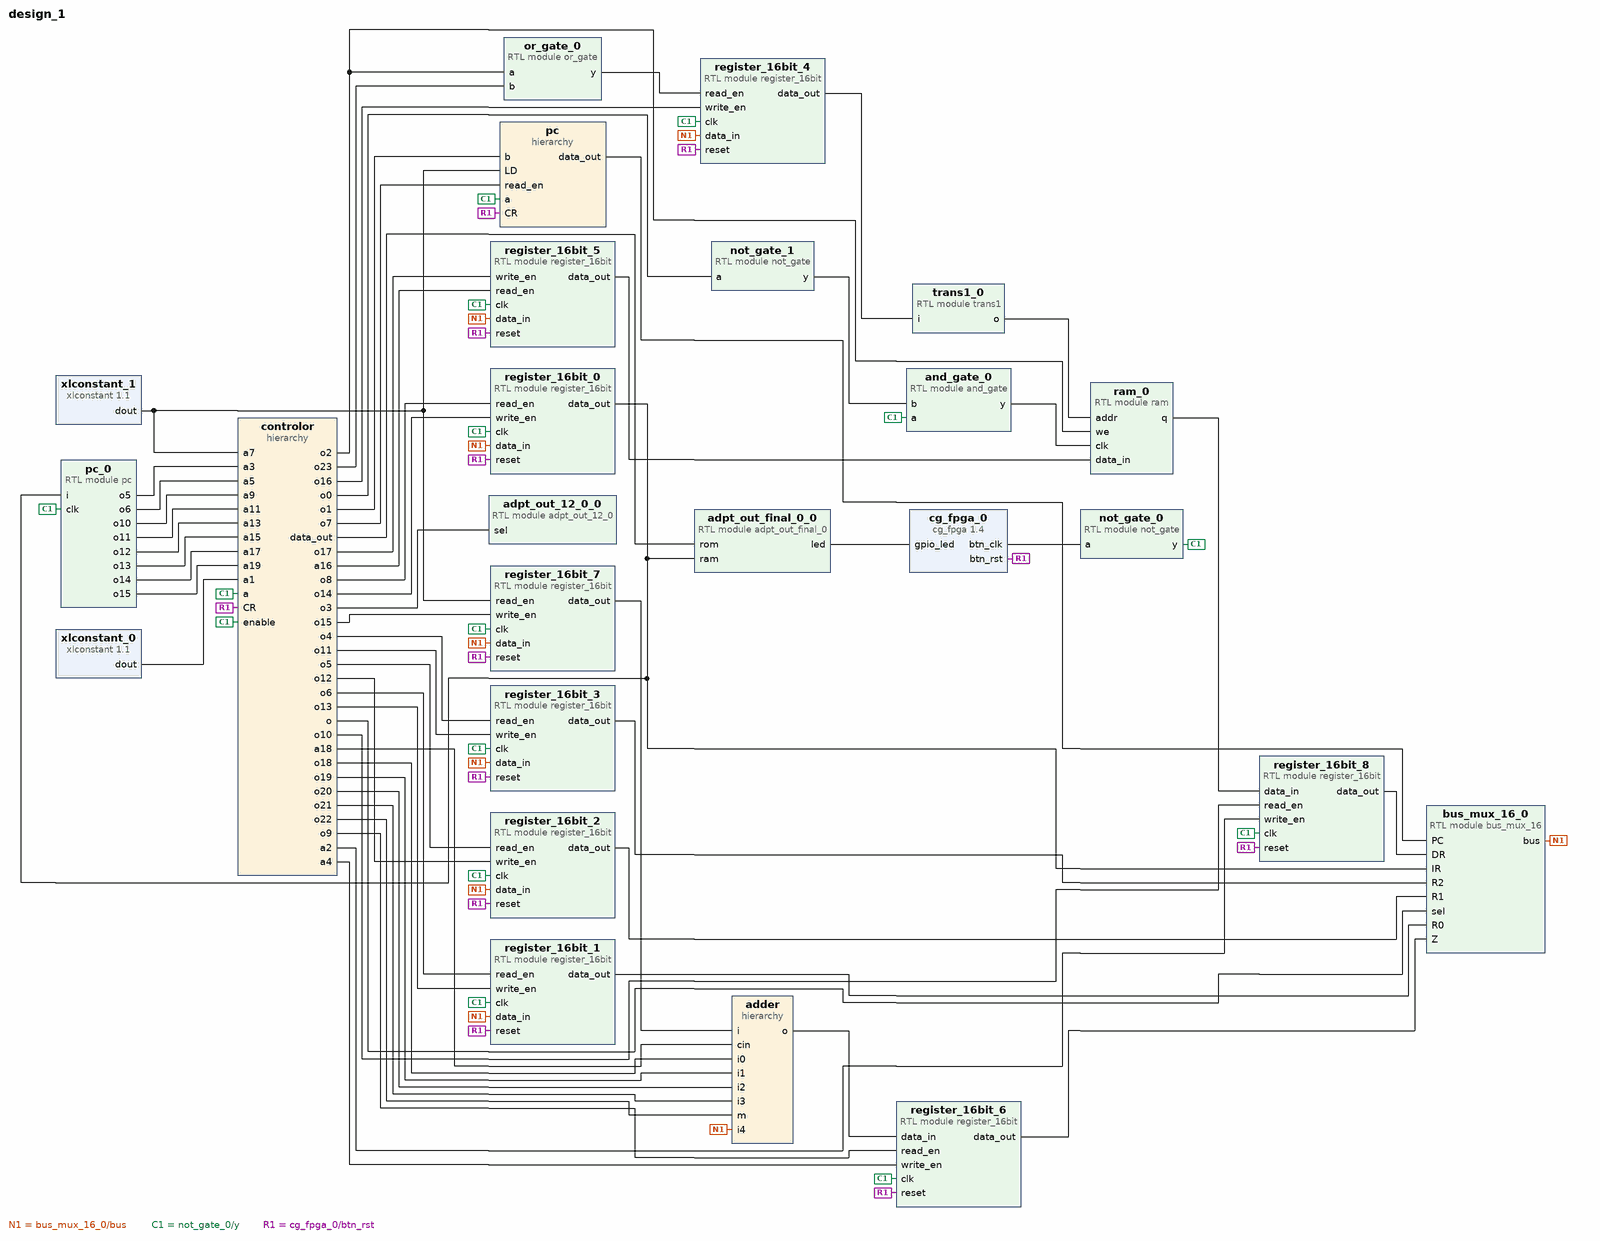
[diagram p0: block diagram of the top level]
# Vivado block design design_1, xc7z020clg400-1, Vivado 2024.2
create_bd_design design_1

create_bd_cell -type ip -vlnv educg.net:user:cg_fpga:1.4 cg_fpga_0
create_bd_cell -type hier adder
create_bd_cell -type ip -vlnv xilinx.com:ip:xlconstant:1.1 xlconstant_0
set_property -dict {CONFIG.CONST_VAL 0} [get_bd_cells xlconstant_0]
create_bd_cell -type ip -vlnv xilinx.com:ip:xlconstant:1.1 xlconstant_1
create_bd_cell -type hier pc
create_bd_cell -type module -reference pc pc_0
create_bd_cell -type module -reference register_16bit register_16bit_0
create_bd_cell -type module -reference bus_mux_16 bus_mux_16_0
create_bd_cell -type module -reference register_16bit register_16bit_1
create_bd_cell -type module -reference register_16bit register_16bit_2
create_bd_cell -type module -reference register_16bit register_16bit_3
create_bd_cell -type module -reference register_16bit register_16bit_4
create_bd_cell -type module -reference register_16bit register_16bit_5
create_bd_cell -type module -reference register_16bit register_16bit_6
create_bd_cell -type module -reference register_16bit register_16bit_7
create_bd_cell -type module -reference register_16bit register_16bit_8
create_bd_cell -type hier controlor
create_bd_cell -type module -reference or_gate or_gate_0
create_bd_cell -type module -reference and_gate and_gate_0
create_bd_cell -type module -reference not_gate not_gate_1
create_bd_cell -type module -reference ram ram_0
create_bd_cell -type module -reference trans1 trans1_0
create_bd_cell -type module -reference not_gate not_gate_0
create_bd_cell -type module -reference adpt_out_final_0 adpt_out_final_0_0
create_bd_cell -type module -reference adpt_out_12_0 adpt_out_12_0_0

# ---- hierarchy /adder ----
current_bd_instance /adder
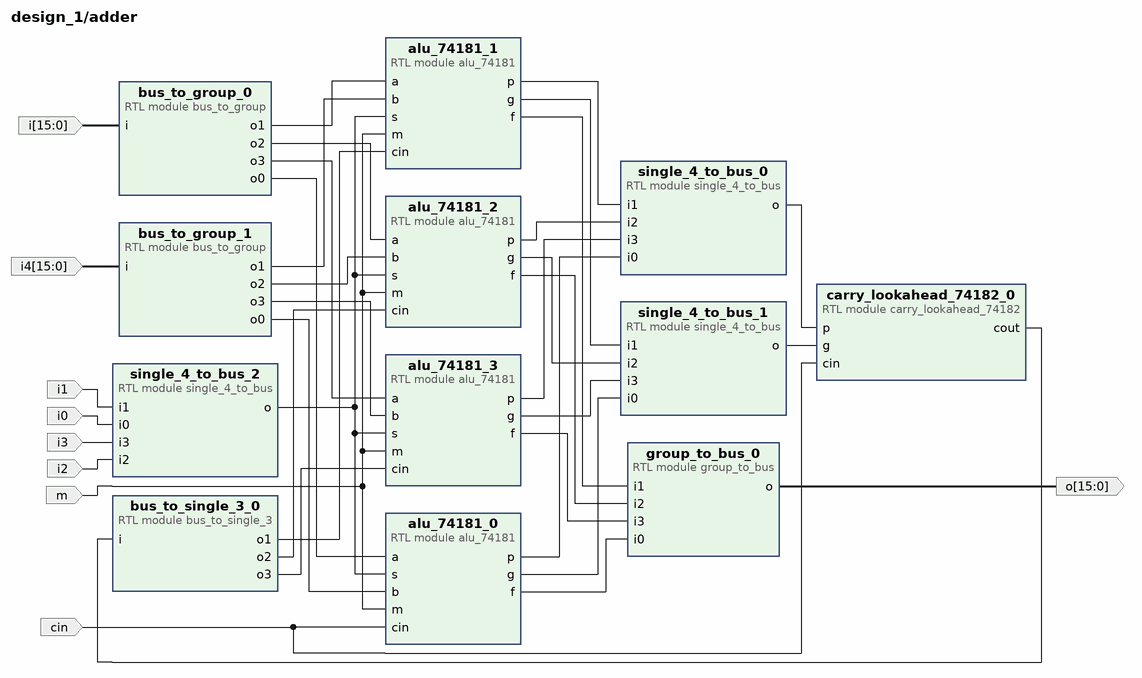
[diagram p1: block diagram inside /adder]
create_bd_pin -dir I -from 15 -to 0 i
create_bd_pin -dir I i3
create_bd_pin -dir I i2
create_bd_pin -dir I i1
create_bd_pin -dir I i0
create_bd_pin -dir I m
create_bd_pin -dir I cin
create_bd_pin -dir O -from 15 -to 0 o
create_bd_pin -dir I -from 15 -to 0 i4

create_bd_cell -type module -reference bus_to_group bus_to_group_0
create_bd_cell -type module -reference bus_to_group bus_to_group_1
create_bd_cell -type module -reference single_4_to_bus single_4_to_bus_2
create_bd_cell -type module -reference alu_74181 alu_74181_3
create_bd_cell -type module -reference alu_74181 alu_74181_2
create_bd_cell -type module -reference alu_74181 alu_74181_1
create_bd_cell -type module -reference alu_74181 alu_74181_0
create_bd_cell -type module -reference single_4_to_bus single_4_to_bus_0
create_bd_cell -type module -reference single_4_to_bus single_4_to_bus_1
create_bd_cell -type module -reference group_to_bus group_to_bus_0
create_bd_cell -type module -reference carry_lookahead_74182 carry_lookahead_74182_0
create_bd_cell -type module -reference bus_to_single_3 bus_to_single_3_0

# ---- hierarchy /pc ----
current_bd_instance /pc
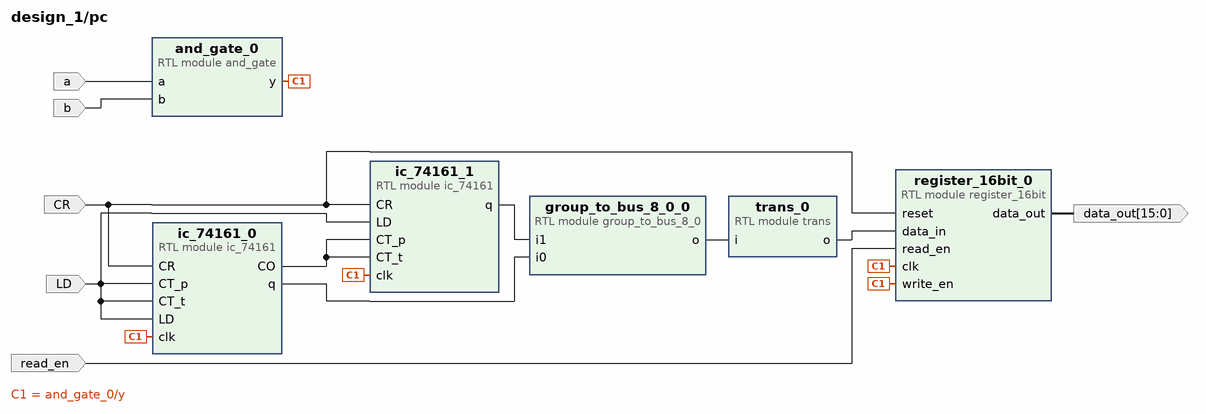
[diagram p2: block diagram inside /pc]
create_bd_pin -dir I a
create_bd_pin -dir I b
create_bd_pin -dir I CR
create_bd_pin -dir I LD
create_bd_pin -dir I read_en
create_bd_pin -dir O -from 15 -to 0 data_out

create_bd_cell -type module -reference and_gate and_gate_0
create_bd_cell -type module -reference group_to_bus_8_0 group_to_bus_8_0_0
create_bd_cell -type module -reference ic_74161 ic_74161_0
create_bd_cell -type module -reference ic_74161 ic_74161_1
create_bd_cell -type module -reference register_16bit register_16bit_0
create_bd_cell -type module -reference trans trans_0

# ---- hierarchy /controlor ----
current_bd_instance /controlor
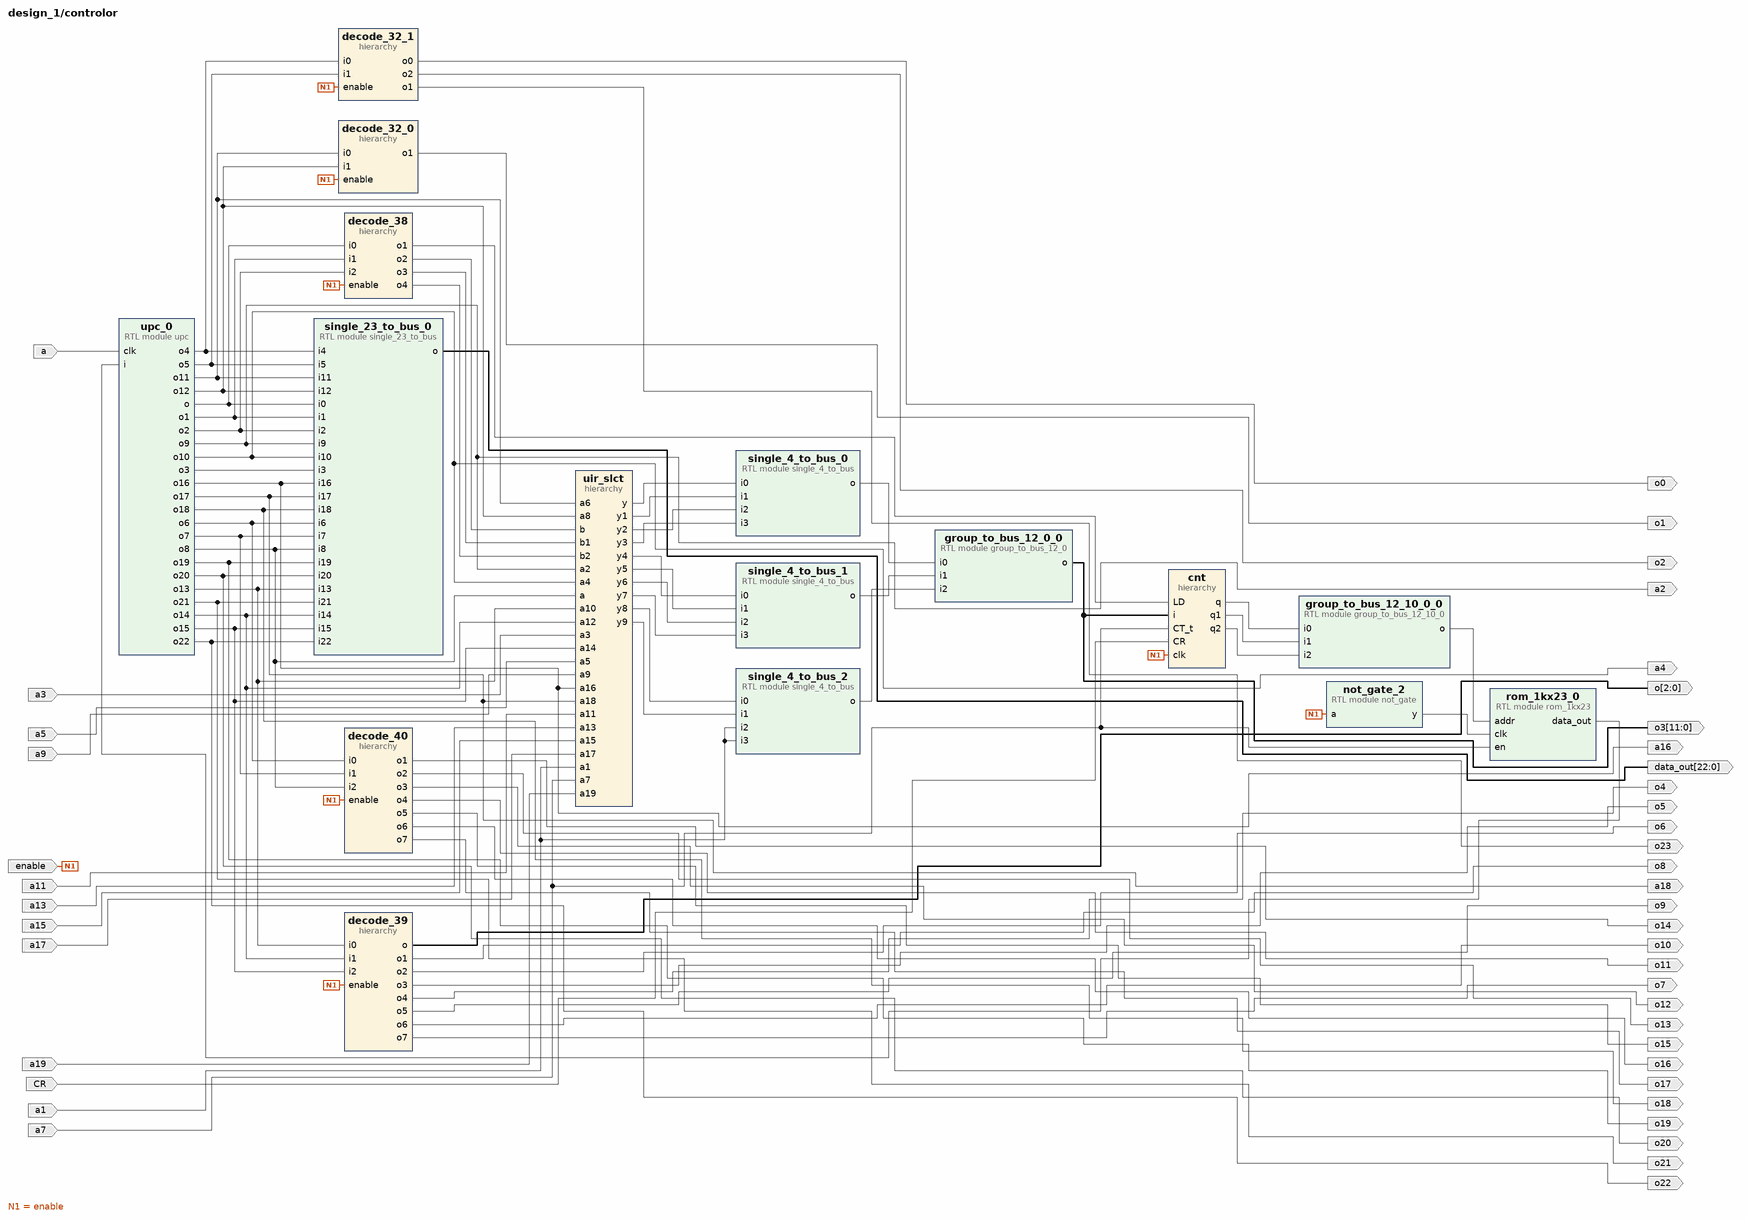
[diagram p3: block diagram inside /controlor]
create_bd_pin -dir I a
create_bd_pin -dir O o22
create_bd_pin -dir O o21
create_bd_pin -dir O o20
create_bd_pin -dir O o19
create_bd_pin -dir O o18
create_bd_pin -dir O a18
create_bd_pin -dir O a16
create_bd_pin -dir O a4
create_bd_pin -dir O a2
create_bd_pin -dir I CR
create_bd_pin -dir I enable
create_bd_pin -dir I a7
create_bd_pin -dir O o0
create_bd_pin -dir O o2
create_bd_pin -dir O o4
create_bd_pin -dir O o5
create_bd_pin -dir O o6
create_bd_pin -dir O o7
create_bd_pin -dir O o8
create_bd_pin -dir O o9
create_bd_pin -dir O o10
create_bd_pin -dir O -from 2 -to 0 o
create_bd_pin -dir O o11
create_bd_pin -dir O o12
create_bd_pin -dir O o13
create_bd_pin -dir O o14
create_bd_pin -dir O o15
create_bd_pin -dir O o16
create_bd_pin -dir O o17
create_bd_pin -dir I a1
create_bd_pin -dir I a3
create_bd_pin -dir I a5
create_bd_pin -dir I a9
create_bd_pin -dir I a11
create_bd_pin -dir I a13
create_bd_pin -dir I a15
create_bd_pin -dir I a17
create_bd_pin -dir I a19
create_bd_pin -dir O o23
create_bd_pin -dir O o1
create_bd_pin -dir O -from 22 -to 0 data_out
create_bd_pin -dir O -from 11 -to 0 o3

create_bd_cell -type module -reference group_to_bus_12_0 group_to_bus_12_0_0
create_bd_cell -type module -reference group_to_bus_12_10_0 group_to_bus_12_10_0_0
create_bd_cell -type module -reference single_4_to_bus single_4_to_bus_1
create_bd_cell -type module -reference single_4_to_bus single_4_to_bus_2
create_bd_cell -type module -reference upc upc_0
create_bd_cell -type hier cnt
create_bd_cell -type hier decode_32_1
create_bd_cell -type hier decode_38
create_bd_cell -type hier decode_39
create_bd_cell -type hier decode_40
create_bd_cell -type hier uir_slct
create_bd_cell -type module -reference single_4_to_bus single_4_to_bus_0
create_bd_cell -type hier decode_32_0
create_bd_cell -type module -reference rom_1kx23 rom_1kx23_0
create_bd_cell -type module -reference single_23_to_bus single_23_to_bus_0
create_bd_cell -type module -reference not_gate not_gate_2

# ---- hierarchy /controlor/cnt ----
current_bd_instance /controlor/cnt
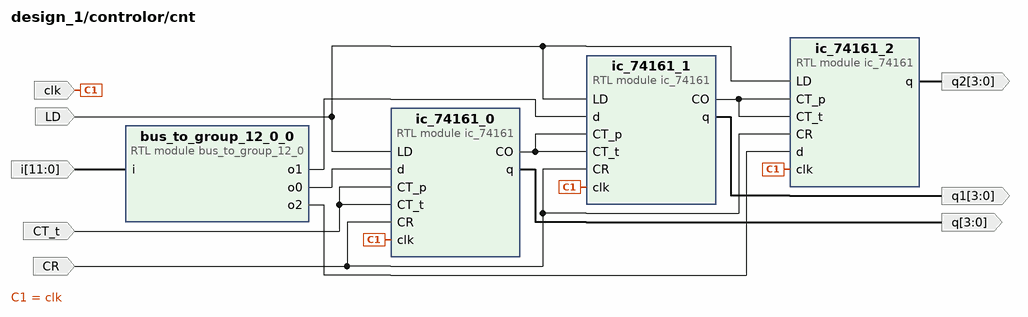
[diagram p4: block diagram inside /controlor/cnt]
create_bd_pin -dir O -from 3 -to 0 q2
create_bd_pin -dir O -from 3 -to 0 q1
create_bd_pin -dir I CR
create_bd_pin -dir O -from 3 -to 0 q
create_bd_pin -dir I -type clk clk
create_bd_pin -dir I -from 11 -to 0 i
create_bd_pin -dir I CT_t
create_bd_pin -dir I LD

create_bd_cell -type module -reference ic_74161 ic_74161_0
create_bd_cell -type module -reference ic_74161 ic_74161_1
create_bd_cell -type module -reference ic_74161 ic_74161_2
create_bd_cell -type module -reference bus_to_group_12_0 bus_to_group_12_0_0

# ---- hierarchy /controlor/decode_32_1 ----
current_bd_instance /controlor/decode_32_1
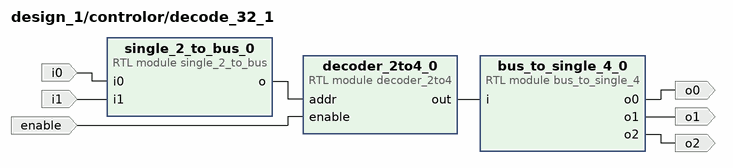
[diagram p5: block diagram inside /controlor/decode_32_1]
create_bd_pin -dir I i1
create_bd_pin -dir I i0
create_bd_pin -dir I enable
create_bd_pin -dir O o0
create_bd_pin -dir O o2
create_bd_pin -dir O o1

create_bd_cell -type module -reference bus_to_single_4 bus_to_single_4_0
create_bd_cell -type module -reference decoder_2to4 decoder_2to4_0
create_bd_cell -type module -reference single_2_to_bus single_2_to_bus_0

# ---- hierarchy /controlor/decode_38 ----
current_bd_instance /controlor/decode_38
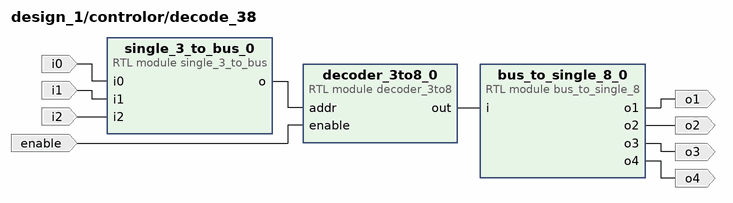
[diagram p6: block diagram inside /controlor/decode_38]
create_bd_pin -dir O o4
create_bd_pin -dir O o3
create_bd_pin -dir O o2
create_bd_pin -dir I enable
create_bd_pin -dir I i2
create_bd_pin -dir I i1
create_bd_pin -dir I i0
create_bd_pin -dir O o1

create_bd_cell -type module -reference bus_to_single_8 bus_to_single_8_0
create_bd_cell -type module -reference decoder_3to8 decoder_3to8_0
create_bd_cell -type module -reference single_3_to_bus single_3_to_bus_0

# ---- hierarchy /controlor/decode_39 ----
current_bd_instance /controlor/decode_39
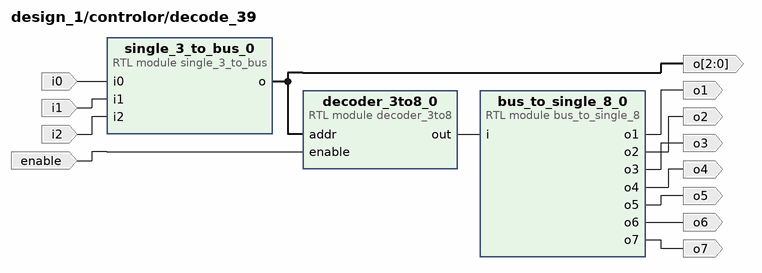
[diagram p7: block diagram inside /controlor/decode_39]
create_bd_pin -dir O o4
create_bd_pin -dir O o3
create_bd_pin -dir O o2
create_bd_pin -dir I enable
create_bd_pin -dir I i2
create_bd_pin -dir I i1
create_bd_pin -dir I i0
create_bd_pin -dir O o7
create_bd_pin -dir O o1
create_bd_pin -dir O o5
create_bd_pin -dir O o6
create_bd_pin -dir O -from 2 -to 0 o

create_bd_cell -type module -reference bus_to_single_8 bus_to_single_8_0
create_bd_cell -type module -reference decoder_3to8 decoder_3to8_0
create_bd_cell -type module -reference single_3_to_bus single_3_to_bus_0

# ---- hierarchy /controlor/decode_40 ----
current_bd_instance /controlor/decode_40
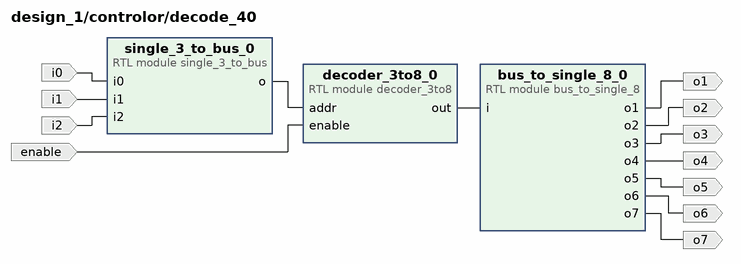
[diagram p8: block diagram inside /controlor/decode_40]
create_bd_pin -dir O o4
create_bd_pin -dir O o3
create_bd_pin -dir O o2
create_bd_pin -dir I enable
create_bd_pin -dir I i2
create_bd_pin -dir I i1
create_bd_pin -dir I i0
create_bd_pin -dir O o1
create_bd_pin -dir O o5
create_bd_pin -dir O o6
create_bd_pin -dir O o7

create_bd_cell -type module -reference bus_to_single_8 bus_to_single_8_0
create_bd_cell -type module -reference decoder_3to8 decoder_3to8_0
create_bd_cell -type module -reference single_3_to_bus single_3_to_bus_0

# ---- hierarchy /controlor/uir_slct ----
current_bd_instance /controlor/uir_slct
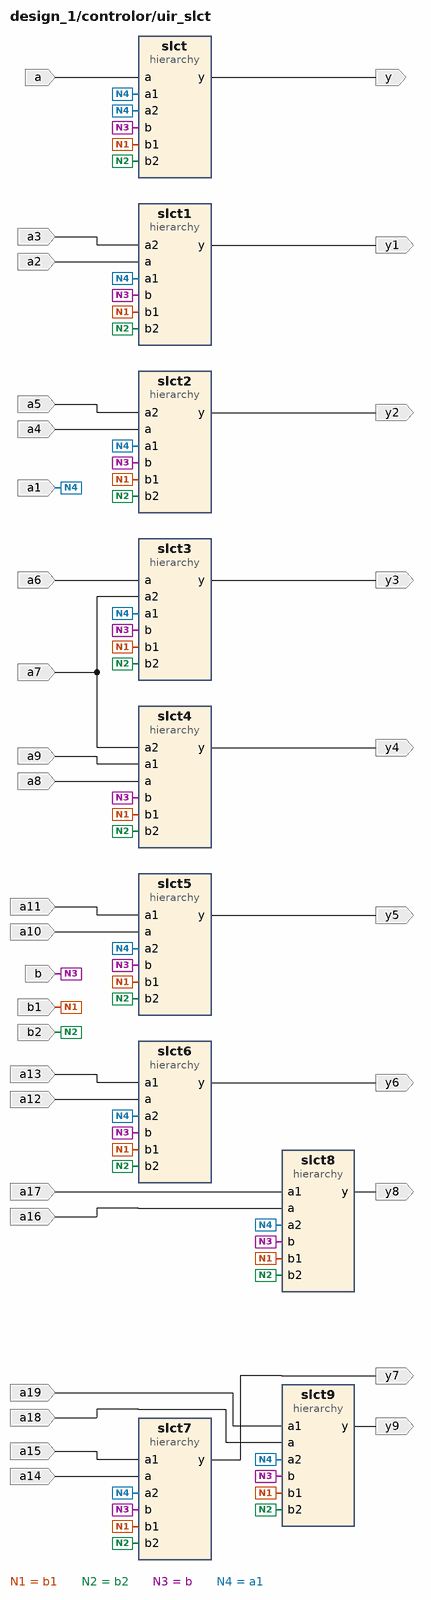
[diagram p9: block diagram inside /controlor/uir_slct]
create_bd_pin -dir I a
create_bd_pin -dir I b
create_bd_pin -dir I a1
create_bd_pin -dir I b1
create_bd_pin -dir I b2
create_bd_pin -dir I a2
create_bd_pin -dir I a3
create_bd_pin -dir I a4
create_bd_pin -dir I a5
create_bd_pin -dir I a6
create_bd_pin -dir I a7
create_bd_pin -dir I a8
create_bd_pin -dir I a9
create_bd_pin -dir I a10
create_bd_pin -dir I a11
create_bd_pin -dir I a12
create_bd_pin -dir I a13
create_bd_pin -dir I a14
create_bd_pin -dir I a15
create_bd_pin -dir I a16
create_bd_pin -dir I a17
create_bd_pin -dir I a18
create_bd_pin -dir I a19
create_bd_pin -dir O y
create_bd_pin -dir O y1
create_bd_pin -dir O y2
create_bd_pin -dir O y3
create_bd_pin -dir O y4
create_bd_pin -dir O y5
create_bd_pin -dir O y6
create_bd_pin -dir O y7
create_bd_pin -dir O y8
create_bd_pin -dir O y9

create_bd_cell -type hier slct
create_bd_cell -type hier slct1
create_bd_cell -type hier slct2
create_bd_cell -type hier slct3
create_bd_cell -type hier slct4
create_bd_cell -type hier slct5
create_bd_cell -type hier slct6
create_bd_cell -type hier slct7
create_bd_cell -type hier slct8
create_bd_cell -type hier slct9

# ---- hierarchy /controlor/uir_slct/slct ----
current_bd_instance /controlor/uir_slct/slct
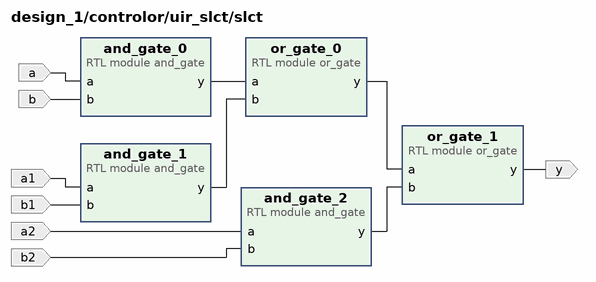
[diagram p10: block diagram inside /controlor/uir_slct/slct]
create_bd_pin -dir I a
create_bd_pin -dir I b
create_bd_pin -dir I a1
create_bd_pin -dir I b1
create_bd_pin -dir I a2
create_bd_pin -dir I b2
create_bd_pin -dir O y

create_bd_cell -type module -reference and_gate and_gate_0
create_bd_cell -type module -reference and_gate and_gate_1
create_bd_cell -type module -reference and_gate and_gate_2
create_bd_cell -type module -reference or_gate or_gate_0
create_bd_cell -type module -reference or_gate or_gate_1

# ---- hierarchy /controlor/uir_slct/slct1 ----
current_bd_instance /controlor/uir_slct/slct1
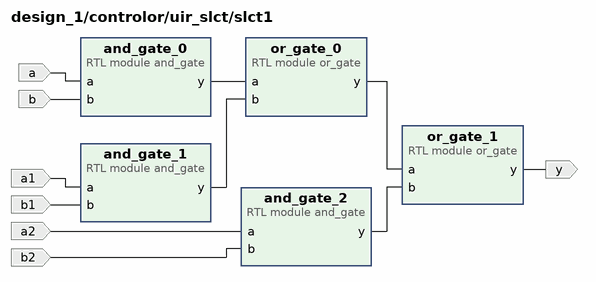
[diagram p11: block diagram inside /controlor/uir_slct/slct1]
create_bd_pin -dir I a
create_bd_pin -dir I b
create_bd_pin -dir I a1
create_bd_pin -dir I b1
create_bd_pin -dir I a2
create_bd_pin -dir I b2
create_bd_pin -dir O y

create_bd_cell -type module -reference and_gate and_gate_0
create_bd_cell -type module -reference and_gate and_gate_1
create_bd_cell -type module -reference and_gate and_gate_2
create_bd_cell -type module -reference or_gate or_gate_0
create_bd_cell -type module -reference or_gate or_gate_1

# ---- hierarchy /controlor/uir_slct/slct2 ----
current_bd_instance /controlor/uir_slct/slct2
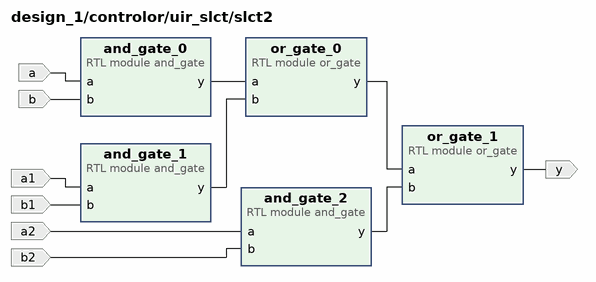
[diagram p12: block diagram inside /controlor/uir_slct/slct2]
create_bd_pin -dir I a
create_bd_pin -dir I b
create_bd_pin -dir I a1
create_bd_pin -dir I b1
create_bd_pin -dir I a2
create_bd_pin -dir I b2
create_bd_pin -dir O y

create_bd_cell -type module -reference and_gate and_gate_0
create_bd_cell -type module -reference and_gate and_gate_1
create_bd_cell -type module -reference and_gate and_gate_2
create_bd_cell -type module -reference or_gate or_gate_0
create_bd_cell -type module -reference or_gate or_gate_1

# ---- hierarchy /controlor/uir_slct/slct3 ----
current_bd_instance /controlor/uir_slct/slct3
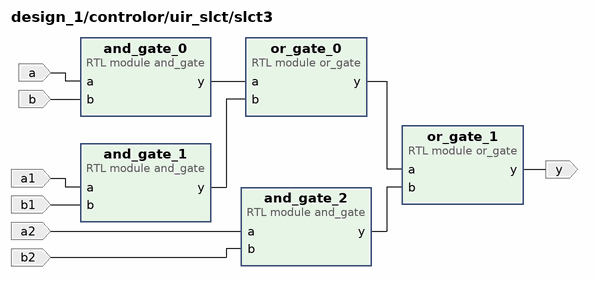
[diagram p13: block diagram inside /controlor/uir_slct/slct3]
create_bd_pin -dir I a
create_bd_pin -dir I b
create_bd_pin -dir I a1
create_bd_pin -dir I b1
create_bd_pin -dir I a2
create_bd_pin -dir I b2
create_bd_pin -dir O y

create_bd_cell -type module -reference and_gate and_gate_0
create_bd_cell -type module -reference and_gate and_gate_1
create_bd_cell -type module -reference and_gate and_gate_2
create_bd_cell -type module -reference or_gate or_gate_0
create_bd_cell -type module -reference or_gate or_gate_1

# ---- hierarchy /controlor/uir_slct/slct4 ----
current_bd_instance /controlor/uir_slct/slct4
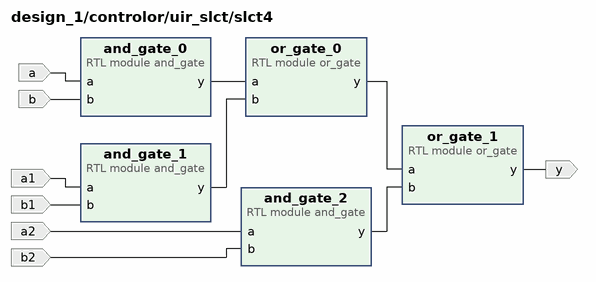
[diagram p14: block diagram inside /controlor/uir_slct/slct4]
create_bd_pin -dir I a
create_bd_pin -dir I b
create_bd_pin -dir I a1
create_bd_pin -dir I b1
create_bd_pin -dir I a2
create_bd_pin -dir I b2
create_bd_pin -dir O y

create_bd_cell -type module -reference and_gate and_gate_0
create_bd_cell -type module -reference and_gate and_gate_1
create_bd_cell -type module -reference and_gate and_gate_2
create_bd_cell -type module -reference or_gate or_gate_0
create_bd_cell -type module -reference or_gate or_gate_1

# ---- hierarchy /controlor/uir_slct/slct5 ----
current_bd_instance /controlor/uir_slct/slct5
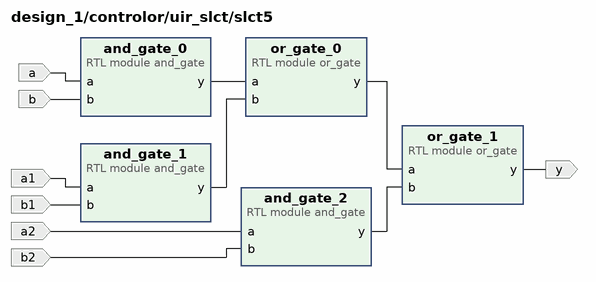
[diagram p15: block diagram inside /controlor/uir_slct/slct5]
create_bd_pin -dir I a
create_bd_pin -dir I b
create_bd_pin -dir I a1
create_bd_pin -dir I b1
create_bd_pin -dir I a2
create_bd_pin -dir I b2
create_bd_pin -dir O y

create_bd_cell -type module -reference and_gate and_gate_0
create_bd_cell -type module -reference and_gate and_gate_1
create_bd_cell -type module -reference and_gate and_gate_2
create_bd_cell -type module -reference or_gate or_gate_0
create_bd_cell -type module -reference or_gate or_gate_1

# ---- hierarchy /controlor/uir_slct/slct6 ----
current_bd_instance /controlor/uir_slct/slct6
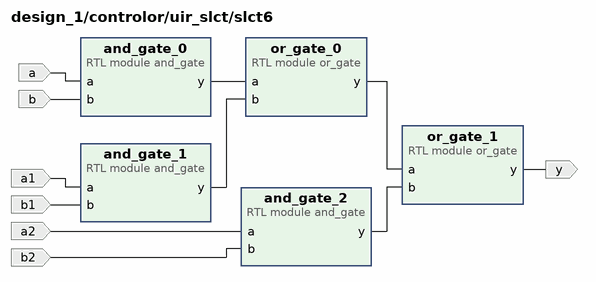
[diagram p16: block diagram inside /controlor/uir_slct/slct6]
create_bd_pin -dir I a
create_bd_pin -dir I b
create_bd_pin -dir I a1
create_bd_pin -dir I b1
create_bd_pin -dir I a2
create_bd_pin -dir I b2
create_bd_pin -dir O y

create_bd_cell -type module -reference and_gate and_gate_0
create_bd_cell -type module -reference and_gate and_gate_1
create_bd_cell -type module -reference and_gate and_gate_2
create_bd_cell -type module -reference or_gate or_gate_0
create_bd_cell -type module -reference or_gate or_gate_1

# ---- hierarchy /controlor/uir_slct/slct7 ----
current_bd_instance /controlor/uir_slct/slct7
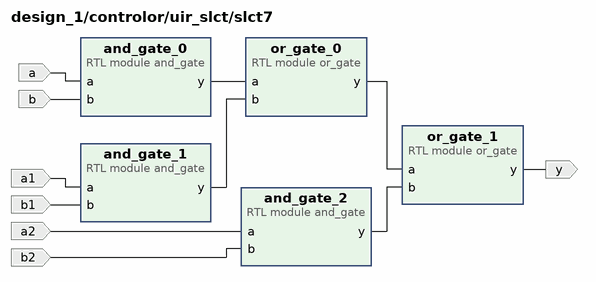
[diagram p17: block diagram inside /controlor/uir_slct/slct7]
create_bd_pin -dir I a
create_bd_pin -dir I b
create_bd_pin -dir I a1
create_bd_pin -dir I b1
create_bd_pin -dir I a2
create_bd_pin -dir I b2
create_bd_pin -dir O y

create_bd_cell -type module -reference and_gate and_gate_0
create_bd_cell -type module -reference and_gate and_gate_1
create_bd_cell -type module -reference and_gate and_gate_2
create_bd_cell -type module -reference or_gate or_gate_0
create_bd_cell -type module -reference or_gate or_gate_1

# ---- hierarchy /controlor/uir_slct/slct8 ----
current_bd_instance /controlor/uir_slct/slct8
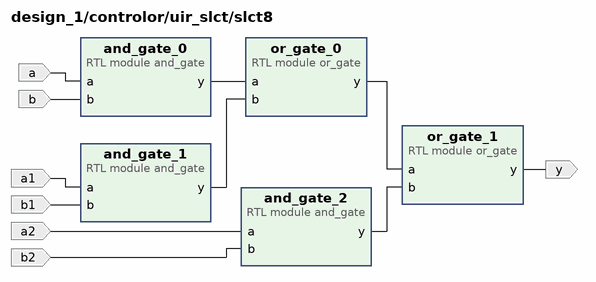
[diagram p18: block diagram inside /controlor/uir_slct/slct8]
create_bd_pin -dir I a
create_bd_pin -dir I b
create_bd_pin -dir I a1
create_bd_pin -dir I b1
create_bd_pin -dir I a2
create_bd_pin -dir I b2
create_bd_pin -dir O y

create_bd_cell -type module -reference and_gate and_gate_0
create_bd_cell -type module -reference and_gate and_gate_1
create_bd_cell -type module -reference and_gate and_gate_2
create_bd_cell -type module -reference or_gate or_gate_0
create_bd_cell -type module -reference or_gate or_gate_1

# ---- hierarchy /controlor/uir_slct/slct9 ----
current_bd_instance /controlor/uir_slct/slct9
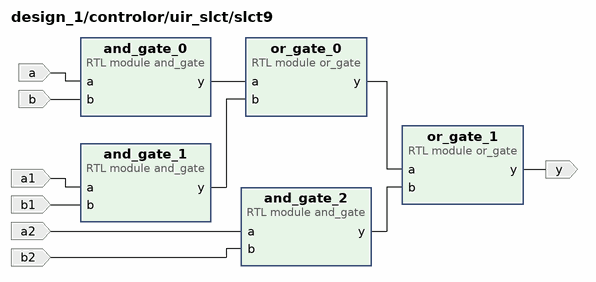
[diagram p19: block diagram inside /controlor/uir_slct/slct9]
create_bd_pin -dir I a
create_bd_pin -dir I b
create_bd_pin -dir I a1
create_bd_pin -dir I b1
create_bd_pin -dir I a2
create_bd_pin -dir I b2
create_bd_pin -dir O y

create_bd_cell -type module -reference and_gate and_gate_0
create_bd_cell -type module -reference and_gate and_gate_1
create_bd_cell -type module -reference and_gate and_gate_2
create_bd_cell -type module -reference or_gate or_gate_0
create_bd_cell -type module -reference or_gate or_gate_1

# ---- hierarchy /controlor/decode_32_0 ----
current_bd_instance /controlor/decode_32_0
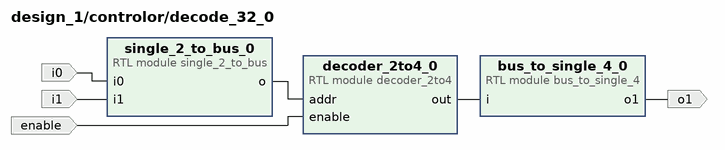
[diagram p20: block diagram inside /controlor/decode_32_0]
create_bd_pin -dir I i1
create_bd_pin -dir I i0
create_bd_pin -dir O o1
create_bd_pin -dir I enable

create_bd_cell -type module -reference bus_to_single_4 bus_to_single_4_0
create_bd_cell -type module -reference decoder_2to4 decoder_2to4_0
create_bd_cell -type module -reference single_2_to_bus single_2_to_bus_0

# ---- connections ----

current_bd_instance /adder
connect_bd_net [get_bd_pins cin] [get_bd_pins carry_lookahead_74182_0/cin] [get_bd_pins alu_74181_0/cin]
connect_bd_net [get_bd_pins m] [get_bd_pins alu_74181_2/m] [get_bd_pins alu_74181_1/m] [get_bd_pins alu_74181_0/m] [get_bd_pins alu_74181_3/m]
connect_bd_net [get_bd_pins single_4_to_bus_2/o] \
  [get_bd_pins alu_74181_3/s] [get_bd_pins alu_74181_2/s] [get_bd_pins alu_74181_1/s] [get_bd_pins alu_74181_0/s]
connect_bd_net [get_bd_pins alu_74181_0/f] [get_bd_pins group_to_bus_0/i0]
connect_bd_net [get_bd_pins alu_74181_0/g] [get_bd_pins single_4_to_bus_1/i0]
connect_bd_net [get_bd_pins alu_74181_0/p] [get_bd_pins single_4_to_bus_0/i0]
connect_bd_net [get_bd_pins alu_74181_1/f] [get_bd_pins group_to_bus_0/i1]
connect_bd_net [get_bd_pins alu_74181_1/g] [get_bd_pins single_4_to_bus_1/i1]
connect_bd_net [get_bd_pins alu_74181_1/p] [get_bd_pins single_4_to_bus_0/i1]
connect_bd_net [get_bd_pins alu_74181_2/f] [get_bd_pins group_to_bus_0/i2]
connect_bd_net [get_bd_pins alu_74181_2/g] [get_bd_pins single_4_to_bus_1/i2]
connect_bd_net [get_bd_pins alu_74181_2/p] [get_bd_pins single_4_to_bus_0/i2]
connect_bd_net [get_bd_pins alu_74181_3/f] [get_bd_pins group_to_bus_0/i3]
connect_bd_net [get_bd_pins alu_74181_3/g] [get_bd_pins single_4_to_bus_1/i3]
connect_bd_net [get_bd_pins alu_74181_3/p] [get_bd_pins single_4_to_bus_0/i3]
connect_bd_net -net bus_mux_16_0_bus [get_bd_pins i1] [get_bd_pins single_4_to_bus_2/i1]
connect_bd_net [get_bd_pins bus_to_group_0/o0] [get_bd_pins alu_74181_0/a]
connect_bd_net [get_bd_pins bus_to_group_0/o1] [get_bd_pins alu_74181_1/a]
connect_bd_net [get_bd_pins bus_to_group_0/o2] [get_bd_pins alu_74181_2/a]
connect_bd_net [get_bd_pins bus_to_group_0/o3] [get_bd_pins alu_74181_3/a]
connect_bd_net [get_bd_pins bus_to_group_1/o0] [get_bd_pins alu_74181_0/b]
connect_bd_net [get_bd_pins bus_to_group_1/o1] [get_bd_pins alu_74181_1/b]
connect_bd_net [get_bd_pins bus_to_group_1/o2] [get_bd_pins alu_74181_2/b]
connect_bd_net [get_bd_pins bus_to_group_1/o3] [get_bd_pins alu_74181_3/b]
connect_bd_net [get_bd_pins bus_to_single_3_0/o1] [get_bd_pins alu_74181_1/cin]
connect_bd_net [get_bd_pins bus_to_single_3_0/o2] [get_bd_pins alu_74181_2/cin]
connect_bd_net [get_bd_pins bus_to_single_3_0/o3] [get_bd_pins alu_74181_3/cin]
connect_bd_net [get_bd_pins carry_lookahead_74182_0/cout] [get_bd_pins bus_to_single_3_0/i]
connect_bd_net -net cg_fpga_0_tx_0 [get_bd_pins i0] [get_bd_pins single_4_to_bus_2/i0]
connect_bd_net [get_bd_pins group_to_bus_0/o] [get_bd_pins o]
connect_bd_net -net i4_1 [get_bd_pins i4] [get_bd_pins bus_to_group_1/i]
connect_bd_net -net register_16bit_0_data_out [get_bd_pins i] [get_bd_pins bus_to_group_0/i]
connect_bd_net -net register_16bit_3_data_out [get_bd_pins i3] [get_bd_pins single_4_to_bus_2/i3]
connect_bd_net -net register_16bit_5_data_out [get_bd_pins i2] [get_bd_pins single_4_to_bus_2/i2]
connect_bd_net [get_bd_pins single_4_to_bus_0/o] [get_bd_pins carry_lookahead_74182_0/p]
connect_bd_net [get_bd_pins single_4_to_bus_1/o] [get_bd_pins carry_lookahead_74182_0/g]

current_bd_instance /pc
connect_bd_net [get_bd_pins LD] [get_bd_pins ic_74161_0/LD] [get_bd_pins ic_74161_0/CT_p] [get_bd_pins ic_74161_0/CT_t] [get_bd_pins ic_74161_1/LD]
connect_bd_net [get_bd_pins a] [get_bd_pins and_gate_0/a]
connect_bd_net [get_bd_pins and_gate_0/y] \
  [get_bd_pins register_16bit_0/clk] [get_bd_pins register_16bit_0/write_en] [get_bd_pins ic_74161_0/clk] \
  [get_bd_pins ic_74161_1/clk]
connect_bd_net -net cg_fpga_0_btn_rst [get_bd_pins CR] [get_bd_pins register_16bit_0/reset] [get_bd_pins ic_74161_0/CR] [get_bd_pins ic_74161_1/CR]
connect_bd_net -net decode_32_0_o1 [get_bd_pins b] [get_bd_pins and_gate_0/b]
connect_bd_net -net decode_39_o7 [get_bd_pins read_en] [get_bd_pins register_16bit_0/read_en]
connect_bd_net [get_bd_pins group_to_bus_8_0_0/o] [get_bd_pins trans_0/i]
connect_bd_net [get_bd_pins ic_74161_0/CO] [get_bd_pins ic_74161_1/CT_p] [get_bd_pins ic_74161_1/CT_t]
connect_bd_net [get_bd_pins ic_74161_0/q] [get_bd_pins group_to_bus_8_0_0/i0]
connect_bd_net [get_bd_pins ic_74161_1/q] [get_bd_pins group_to_bus_8_0_0/i1]
connect_bd_net [get_bd_pins register_16bit_0/data_out] [get_bd_pins data_out]
connect_bd_net [get_bd_pins trans_0/o] [get_bd_pins register_16bit_0/data_in]

current_bd_instance /controlor
connect_bd_net -net LD_1 [get_bd_pins decode_38/o1] [get_bd_pins cnt/LD]
connect_bd_net [get_bd_pins enable] \
  [get_bd_pins decode_38/enable] [get_bd_pins decode_39/enable] [get_bd_pins decode_40/enable] \
  [get_bd_pins decode_32_1/enable] [get_bd_pins cnt/clk] [get_bd_pins decode_32_0/enable] [get_bd_pins not_gate_2/a]
connect_bd_net -net and_gate_2_y [get_bd_pins a] [get_bd_pins upc_0/clk]
connect_bd_net -net bus_to_single_8_0_o2 [get_bd_pins decode_38/o2] [get_bd_pins uir_slct/b]
connect_bd_net -net bus_to_single_8_0_o3 [get_bd_pins decode_38/o3] [get_bd_pins uir_slct/b1]
connect_bd_net -net bus_to_single_8_0_o4 [get_bd_pins decode_38/o4] [get_bd_pins uir_slct/b2]
connect_bd_net -net cg_fpga_0_btn_rst [get_bd_pins CR] [get_bd_pins cnt/CR]
connect_bd_net [get_bd_pins cnt/q] [get_bd_pins group_to_bus_12_10_0_0/i0]
connect_bd_net [get_bd_pins cnt/q1] [get_bd_pins group_to_bus_12_10_0_0/i1]
connect_bd_net [get_bd_pins cnt/q2] [get_bd_pins group_to_bus_12_10_0_0/i2]
connect_bd_net [get_bd_pins decode_32_0/o1] [get_bd_pins o1]
connect_bd_net [get_bd_pins decode_32_1/o0] [get_bd_pins o0]
connect_bd_net [get_bd_pins decode_32_1/o1] [get_bd_pins o23]
connect_bd_net [get_bd_pins decode_32_1/o2] [get_bd_pins o2]
connect_bd_net [get_bd_pins decode_39/o] [get_bd_pins o]
connect_bd_net [get_bd_pins decode_39/o1] [get_bd_pins o8]
connect_bd_net [get_bd_pins decode_39/o2] [get_bd_pins o6]
connect_bd_net [get_bd_pins decode_39/o3] [get_bd_pins o5]
connect_bd_net [get_bd_pins decode_39/o4] [get_bd_pins o4]
connect_bd_net [get_bd_pins decode_39/o5] [get_bd_pins o9]
connect_bd_net [get_bd_pins decode_39/o6] [get_bd_pins o10]
connect_bd_net [get_bd_pins decode_39/o7] [get_bd_pins o7]
connect_bd_net [get_bd_pins decode_40/o1] [get_bd_pins o14]
connect_bd_net [get_bd_pins decode_40/o2] [get_bd_pins o13]
connect_bd_net [get_bd_pins decode_40/o3] [get_bd_pins o12]
connect_bd_net [get_bd_pins decode_40/o4] [get_bd_pins o11]
connect_bd_net [get_bd_pins decode_40/o5] [get_bd_pins o15]
connect_bd_net [get_bd_pins decode_40/o6] [get_bd_pins o16]
connect_bd_net [get_bd_pins decode_40/o7] [get_bd_pins o17]
connect_bd_net [get_bd_pins group_to_bus_12_0_0/o] [get_bd_pins cnt/i] [get_bd_pins o3]
connect_bd_net [get_bd_pins group_to_bus_12_10_0_0/o] [get_bd_pins rom_1kx23_0/addr]
connect_bd_net [get_bd_pins not_gate_2/y] [get_bd_pins rom_1kx23_0/clk]
connect_bd_net -net pc_0_o5 [get_bd_pins a3] [get_bd_pins uir_slct/a3]
connect_bd_net -net pc_0_o6 [get_bd_pins a5] [get_bd_pins uir_slct/a5]
connect_bd_net -net pc_0_o10 [get_bd_pins a9] [get_bd_pins uir_slct/a9]
connect_bd_net -net pc_0_o11 [get_bd_pins a11] [get_bd_pins uir_slct/a11]
connect_bd_net -net pc_0_o12 [get_bd_pins a13] [get_bd_pins uir_slct/a13]
connect_bd_net -net pc_0_o13 [get_bd_pins a15] [get_bd_pins uir_slct/a15]
connect_bd_net -net pc_0_o14 [get_bd_pins a17] [get_bd_pins uir_slct/a17]
connect_bd_net -net pc_0_o15 [get_bd_pins a19] [get_bd_pins uir_slct/a19]
connect_bd_net [get_bd_pins rom_1kx23_0/data_out] [get_bd_pins upc_0/i]
connect_bd_net [get_bd_pins single_23_to_bus_0/o] [get_bd_pins data_out]
connect_bd_net [get_bd_pins single_4_to_bus_0/o] [get_bd_pins group_to_bus_12_0_0/i0]
connect_bd_net [get_bd_pins single_4_to_bus_1/o] [get_bd_pins group_to_bus_12_0_0/i1]
connect_bd_net [get_bd_pins single_4_to_bus_2/o] [get_bd_pins group_to_bus_12_0_0/i2]
connect_bd_net [get_bd_pins uir_slct/y] [get_bd_pins single_4_to_bus_0/i0]
connect_bd_net [get_bd_pins uir_slct/y1] [get_bd_pins single_4_to_bus_0/i1]
connect_bd_net [get_bd_pins uir_slct/y2] [get_bd_pins single_4_to_bus_0/i2]
connect_bd_net [get_bd_pins uir_slct/y3] [get_bd_pins single_4_to_bus_0/i3]
connect_bd_net [get_bd_pins uir_slct/y4] [get_bd_pins single_4_to_bus_1/i0]
connect_bd_net [get_bd_pins uir_slct/y5] [get_bd_pins single_4_to_bus_1/i1]
connect_bd_net [get_bd_pins uir_slct/y6] [get_bd_pins single_4_to_bus_1/i2]
connect_bd_net [get_bd_pins uir_slct/y7] [get_bd_pins single_4_to_bus_1/i3]
connect_bd_net [get_bd_pins uir_slct/y8] [get_bd_pins single_4_to_bus_2/i0]
connect_bd_net [get_bd_pins uir_slct/y9] [get_bd_pins single_4_to_bus_2/i1]
connect_bd_net [get_bd_pins upc_0/o] [get_bd_pins decode_38/i0] [get_bd_pins single_23_to_bus_0/i0]
connect_bd_net [get_bd_pins upc_0/o1] [get_bd_pins decode_38/i1] [get_bd_pins single_23_to_bus_0/i1]
connect_bd_net [get_bd_pins upc_0/o2] [get_bd_pins decode_38/i2] [get_bd_pins single_23_to_bus_0/i2]
connect_bd_net [get_bd_pins upc_0/o3] [get_bd_pins single_23_to_bus_0/i3]
connect_bd_net [get_bd_pins upc_0/o4] [get_bd_pins decode_32_1/i0] [get_bd_pins single_23_to_bus_0/i4]
connect_bd_net [get_bd_pins upc_0/o5] [get_bd_pins decode_32_1/i1] [get_bd_pins single_23_to_bus_0/i5]
connect_bd_net [get_bd_pins upc_0/o6] [get_bd_pins decode_40/i0] [get_bd_pins single_23_to_bus_0/i6]
connect_bd_net [get_bd_pins upc_0/o7] [get_bd_pins decode_40/i1] [get_bd_pins single_23_to_bus_0/i7]
connect_bd_net [get_bd_pins upc_0/o8] [get_bd_pins uir_slct/a] [get_bd_pins decode_40/i2] [get_bd_pins single_23_to_bus_0/i8]
connect_bd_net [get_bd_pins upc_0/o9] [get_bd_pins a2] [get_bd_pins uir_slct/a2] [get_bd_pins single_23_to_bus_0/i9]
connect_bd_net [get_bd_pins upc_0/o10] [get_bd_pins a4] [get_bd_pins uir_slct/a4] [get_bd_pins single_23_to_bus_0/i10]
connect_bd_net [get_bd_pins upc_0/o11] [get_bd_pins uir_slct/a6] [get_bd_pins decode_32_0/i0] [get_bd_pins single_23_to_bus_0/i11]
connect_bd_net [get_bd_pins upc_0/o12] [get_bd_pins uir_slct/a8] [get_bd_pins decode_32_0/i1] [get_bd_pins single_23_to_bus_0/i12]
connect_bd_net [get_bd_pins upc_0/o13] [get_bd_pins uir_slct/a10] [get_bd_pins decode_39/i0] [get_bd_pins single_23_to_bus_0/i13]
connect_bd_net [get_bd_pins upc_0/o14] [get_bd_pins uir_slct/a12] [get_bd_pins decode_39/i1] [get_bd_pins single_23_to_bus_0/i14]
connect_bd_net [get_bd_pins upc_0/o15] [get_bd_pins uir_slct/a14] [get_bd_pins decode_39/i2] [get_bd_pins single_23_to_bus_0/i15]
connect_bd_net [get_bd_pins upc_0/o16] [get_bd_pins a16] [get_bd_pins uir_slct/a16] [get_bd_pins single_23_to_bus_0/i16]
connect_bd_net [get_bd_pins upc_0/o17] [get_bd_pins a18] [get_bd_pins uir_slct/a18] [get_bd_pins single_23_to_bus_0/i17]
connect_bd_net [get_bd_pins upc_0/o18] [get_bd_pins o18] [get_bd_pins single_23_to_bus_0/i18]
connect_bd_net [get_bd_pins upc_0/o19] [get_bd_pins o19] [get_bd_pins single_23_to_bus_0/i19]
connect_bd_net [get_bd_pins upc_0/o20] [get_bd_pins o20] [get_bd_pins single_23_to_bus_0/i20]
connect_bd_net [get_bd_pins upc_0/o21] [get_bd_pins o21] [get_bd_pins single_23_to_bus_0/i21]
connect_bd_net [get_bd_pins upc_0/o22] [get_bd_pins o22] [get_bd_pins single_23_to_bus_0/i22]
connect_bd_net -net xlconstant_0_dout [get_bd_pins a1] [get_bd_pins uir_slct/a1] [get_bd_pins single_4_to_bus_2/i3] [get_bd_pins single_4_to_bus_2/i2]
connect_bd_net -net xlconstant_1_dout [get_bd_pins a7] [get_bd_pins uir_slct/a7] [get_bd_pins cnt/CT_t] [get_bd_pins rom_1kx23_0/en]

current_bd_instance /controlor/cnt
connect_bd_net -net D_trigger_0_q [get_bd_pins LD] [get_bd_pins ic_74161_0/LD] [get_bd_pins ic_74161_2/LD] [get_bd_pins ic_74161_1/LD]
connect_bd_net -net LD_1 [get_bd_pins CT_t] [get_bd_pins ic_74161_0/CT_p] [get_bd_pins ic_74161_0/CT_t]
connect_bd_net [get_bd_pins CR] [get_bd_pins ic_74161_0/CR] [get_bd_pins ic_74161_2/CR] [get_bd_pins ic_74161_1/CR]
connect_bd_net [get_bd_pins bus_to_group_12_0_0/o0] [get_bd_pins ic_74161_0/d]
connect_bd_net [get_bd_pins bus_to_group_12_0_0/o1] [get_bd_pins ic_74161_1/d]
connect_bd_net [get_bd_pins bus_to_group_12_0_0/o2] [get_bd_pins ic_74161_2/d]
connect_bd_net [get_bd_pins i] [get_bd_pins bus_to_group_12_0_0/i]
connect_bd_net [get_bd_pins ic_74161_0/CO] [get_bd_pins ic_74161_1/CT_p] [get_bd_pins ic_74161_1/CT_t]
connect_bd_net [get_bd_pins ic_74161_0/q] [get_bd_pins q]
connect_bd_net [get_bd_pins ic_74161_1/CO] [get_bd_pins ic_74161_2/CT_p] [get_bd_pins ic_74161_2/CT_t]
connect_bd_net [get_bd_pins ic_74161_1/q] [get_bd_pins q1]
connect_bd_net [get_bd_pins ic_74161_2/q] [get_bd_pins q2]
connect_bd_net -net not_gate_0_y [get_bd_pins clk] [get_bd_pins ic_74161_0/clk] [get_bd_pins ic_74161_2/clk] [get_bd_pins ic_74161_1/clk]

current_bd_instance /controlor/decode_32_1
connect_bd_net [get_bd_pins bus_to_single_4_0/o0] [get_bd_pins o0]
connect_bd_net [get_bd_pins bus_to_single_4_0/o1] [get_bd_pins o1]
connect_bd_net [get_bd_pins bus_to_single_4_0/o2] [get_bd_pins o2]
connect_bd_net [get_bd_pins decoder_2to4_0/out] [get_bd_pins bus_to_single_4_0/i]
connect_bd_net [get_bd_pins enable] [get_bd_pins decoder_2to4_0/enable]
connect_bd_net [get_bd_pins single_2_to_bus_0/o] [get_bd_pins decoder_2to4_0/addr]
connect_bd_net -net upc_0_o11 [get_bd_pins i0] [get_bd_pins single_2_to_bus_0/i0]
connect_bd_net -net upc_0_o12 [get_bd_pins i1] [get_bd_pins single_2_to_bus_0/i1]

current_bd_instance /controlor/decode_38
connect_bd_net [get_bd_pins enable] [get_bd_pins decoder_3to8_0/enable]
connect_bd_net [get_bd_pins bus_to_single_8_0/o1] [get_bd_pins o1]
connect_bd_net [get_bd_pins bus_to_single_8_0/o2] [get_bd_pins o2]
connect_bd_net [get_bd_pins bus_to_single_8_0/o3] [get_bd_pins o3]
connect_bd_net [get_bd_pins bus_to_single_8_0/o4] [get_bd_pins o4]
connect_bd_net [get_bd_pins decoder_3to8_0/out] [get_bd_pins bus_to_single_8_0/i]
connect_bd_net [get_bd_pins single_3_to_bus_0/o] [get_bd_pins decoder_3to8_0/addr]
connect_bd_net -net upc_0_o [get_bd_pins i0] [get_bd_pins single_3_to_bus_0/i0]
connect_bd_net -net upc_0_o1 [get_bd_pins i1] [get_bd_pins single_3_to_bus_0/i1]
connect_bd_net -net upc_0_o2 [get_bd_pins i2] [get_bd_pins single_3_to_bus_0/i2]

current_bd_instance /controlor/decode_39
connect_bd_net [get_bd_pins enable] [get_bd_pins decoder_3to8_0/enable]
connect_bd_net [get_bd_pins bus_to_single_8_0/o1] [get_bd_pins o1]
connect_bd_net [get_bd_pins bus_to_single_8_0/o2] [get_bd_pins o2]
connect_bd_net [get_bd_pins bus_to_single_8_0/o3] [get_bd_pins o3]
connect_bd_net [get_bd_pins bus_to_single_8_0/o4] [get_bd_pins o4]
connect_bd_net [get_bd_pins bus_to_single_8_0/o5] [get_bd_pins o5]
connect_bd_net [get_bd_pins bus_to_single_8_0/o6] [get_bd_pins o6]
connect_bd_net [get_bd_pins bus_to_single_8_0/o7] [get_bd_pins o7]
connect_bd_net [get_bd_pins decoder_3to8_0/out] [get_bd_pins bus_to_single_8_0/i]
connect_bd_net [get_bd_pins single_3_to_bus_0/o] [get_bd_pins decoder_3to8_0/addr] [get_bd_pins o]
connect_bd_net -net upc_0_o [get_bd_pins i0] [get_bd_pins single_3_to_bus_0/i0]
connect_bd_net -net upc_0_o1 [get_bd_pins i1] [get_bd_pins single_3_to_bus_0/i1]
connect_bd_net -net upc_0_o2 [get_bd_pins i2] [get_bd_pins single_3_to_bus_0/i2]

current_bd_instance /controlor/decode_40
connect_bd_net [get_bd_pins enable] [get_bd_pins decoder_3to8_0/enable]
connect_bd_net [get_bd_pins bus_to_single_8_0/o1] [get_bd_pins o1]
connect_bd_net [get_bd_pins bus_to_single_8_0/o2] [get_bd_pins o2]
connect_bd_net [get_bd_pins bus_to_single_8_0/o3] [get_bd_pins o3]
connect_bd_net [get_bd_pins bus_to_single_8_0/o4] [get_bd_pins o4]
connect_bd_net [get_bd_pins bus_to_single_8_0/o5] [get_bd_pins o5]
connect_bd_net [get_bd_pins bus_to_single_8_0/o6] [get_bd_pins o6]
connect_bd_net [get_bd_pins bus_to_single_8_0/o7] [get_bd_pins o7]
connect_bd_net [get_bd_pins decoder_3to8_0/out] [get_bd_pins bus_to_single_8_0/i]
connect_bd_net [get_bd_pins single_3_to_bus_0/o] [get_bd_pins decoder_3to8_0/addr]
connect_bd_net -net upc_0_o [get_bd_pins i0] [get_bd_pins single_3_to_bus_0/i0]
connect_bd_net -net upc_0_o1 [get_bd_pins i1] [get_bd_pins single_3_to_bus_0/i1]
connect_bd_net -net upc_0_o2 [get_bd_pins i2] [get_bd_pins single_3_to_bus_0/i2]

current_bd_instance /controlor/uir_slct
connect_bd_net -net a1_1 [get_bd_pins a19] [get_bd_pins slct9/a1]
connect_bd_net -net a1_2 [get_bd_pins a17] [get_bd_pins slct8/a1]
connect_bd_net -net a1_3 [get_bd_pins a15] [get_bd_pins slct7/a1]
connect_bd_net -net a1_4 [get_bd_pins a13] [get_bd_pins slct6/a1]
connect_bd_net -net a1_5 [get_bd_pins a11] [get_bd_pins slct5/a1]
connect_bd_net -net a1_6 [get_bd_pins a9] [get_bd_pins slct4/a1]
connect_bd_net -net a2_1 [get_bd_pins a5] [get_bd_pins slct2/a2]
connect_bd_net -net a2_2 [get_bd_pins a3] [get_bd_pins slct1/a2]
connect_bd_net -net b1_1 [get_bd_pins b1] \
  [get_bd_pins slct1/b1] [get_bd_pins slct2/b1] [get_bd_pins slct3/b1] [get_bd_pins slct4/b1] [get_bd_pins slct5/b1] \
  [get_bd_pins slct6/b1] [get_bd_pins slct7/b1] [get_bd_pins slct8/b1] [get_bd_pins slct9/b1] [get_bd_pins slct/b1]
connect_bd_net -net b2_1 [get_bd_pins b2] \
  [get_bd_pins slct1/b2] [get_bd_pins slct2/b2] [get_bd_pins slct3/b2] [get_bd_pins slct4/b2] [get_bd_pins slct5/b2] \
  [get_bd_pins slct6/b2] [get_bd_pins slct7/b2] [get_bd_pins slct8/b2] [get_bd_pins slct9/b2] [get_bd_pins slct/b2]
connect_bd_net [get_bd_pins b] \
  [get_bd_pins slct4/b] [get_bd_pins slct5/b] [get_bd_pins slct6/b] [get_bd_pins slct7/b] [get_bd_pins slct1/b] \
  [get_bd_pins slct3/b] [get_bd_pins slct8/b] [get_bd_pins slct2/b] [get_bd_pins slct9/b] [get_bd_pins slct/b]
connect_bd_net [get_bd_pins slct1/y] [get_bd_pins y1]
connect_bd_net [get_bd_pins slct2/y] [get_bd_pins y2]
connect_bd_net [get_bd_pins slct3/y] [get_bd_pins y3]
connect_bd_net [get_bd_pins slct4/y] [get_bd_pins y4]
connect_bd_net [get_bd_pins slct5/y] [get_bd_pins y5]
connect_bd_net [get_bd_pins slct6/y] [get_bd_pins y6]
connect_bd_net [get_bd_pins slct7/y] [get_bd_pins y7]
connect_bd_net [get_bd_pins slct8/y] [get_bd_pins y8]
connect_bd_net [get_bd_pins slct9/y] [get_bd_pins y9]
connect_bd_net [get_bd_pins slct/y] [get_bd_pins y]
connect_bd_net -net upc_0_o8 [get_bd_pins a] [get_bd_pins slct/a]
connect_bd_net -net upc_0_o9 [get_bd_pins a2] [get_bd_pins slct1/a]
connect_bd_net -net upc_0_o10 [get_bd_pins a4] [get_bd_pins slct2/a]
connect_bd_net -net upc_0_o11 [get_bd_pins a6] [get_bd_pins slct3/a]
connect_bd_net -net upc_0_o12 [get_bd_pins a8] [get_bd_pins slct4/a]
connect_bd_net -net upc_0_o13 [get_bd_pins a10] [get_bd_pins slct5/a]
connect_bd_net -net upc_0_o14 [get_bd_pins a12] [get_bd_pins slct6/a]
connect_bd_net -net upc_0_o15 [get_bd_pins a14] [get_bd_pins slct7/a]
connect_bd_net -net upc_0_o16 [get_bd_pins a16] [get_bd_pins slct8/a]
connect_bd_net -net upc_0_o17 [get_bd_pins a18] [get_bd_pins slct9/a]
connect_bd_net -net xlconstant_0_dout [get_bd_pins a1] \
  [get_bd_pins slct1/a1] [get_bd_pins slct2/a1] [get_bd_pins slct3/a1] [get_bd_pins slct/a2] [get_bd_pins slct9/a2] \
  [get_bd_pins slct8/a2] [get_bd_pins slct7/a2] [get_bd_pins slct6/a2] [get_bd_pins slct5/a2] [get_bd_pins slct/a1]
connect_bd_net -net xlconstant_1_dout [get_bd_pins a7] [get_bd_pins slct4/a2] [get_bd_pins slct3/a2]

current_bd_instance /controlor/uir_slct/slct
connect_bd_net -net a1_1 [get_bd_pins a1] [get_bd_pins and_gate_1/a]
connect_bd_net -net a2_1 [get_bd_pins a2] [get_bd_pins and_gate_2/a]
connect_bd_net [get_bd_pins a] [get_bd_pins and_gate_0/a]
connect_bd_net [get_bd_pins and_gate_0/y] [get_bd_pins or_gate_0/a]
connect_bd_net [get_bd_pins and_gate_1/y] [get_bd_pins or_gate_0/b]
connect_bd_net [get_bd_pins and_gate_2/y] [get_bd_pins or_gate_1/b]
connect_bd_net -net b1_1 [get_bd_pins b1] [get_bd_pins and_gate_1/b]
connect_bd_net -net b2_1 [get_bd_pins b2] [get_bd_pins and_gate_2/b]
connect_bd_net [get_bd_pins b] [get_bd_pins and_gate_0/b]
connect_bd_net [get_bd_pins or_gate_0/y] [get_bd_pins or_gate_1/a]
connect_bd_net [get_bd_pins or_gate_1/y] [get_bd_pins y]

current_bd_instance /controlor/uir_slct/slct1
connect_bd_net -net a1_1 [get_bd_pins a1] [get_bd_pins and_gate_1/a]
connect_bd_net -net a2_1 [get_bd_pins a2] [get_bd_pins and_gate_2/a]
connect_bd_net [get_bd_pins a] [get_bd_pins and_gate_0/a]
connect_bd_net [get_bd_pins and_gate_0/y] [get_bd_pins or_gate_0/a]
connect_bd_net [get_bd_pins and_gate_1/y] [get_bd_pins or_gate_0/b]
connect_bd_net [get_bd_pins and_gate_2/y] [get_bd_pins or_gate_1/b]
connect_bd_net -net b1_1 [get_bd_pins b1] [get_bd_pins and_gate_1/b]
connect_bd_net -net b2_1 [get_bd_pins b2] [get_bd_pins and_gate_2/b]
connect_bd_net [get_bd_pins b] [get_bd_pins and_gate_0/b]
connect_bd_net [get_bd_pins or_gate_0/y] [get_bd_pins or_gate_1/a]
connect_bd_net [get_bd_pins or_gate_1/y] [get_bd_pins y]

current_bd_instance /controlor/uir_slct/slct2
connect_bd_net -net a1_1 [get_bd_pins a1] [get_bd_pins and_gate_1/a]
connect_bd_net -net a2_1 [get_bd_pins a2] [get_bd_pins and_gate_2/a]
connect_bd_net [get_bd_pins a] [get_bd_pins and_gate_0/a]
connect_bd_net [get_bd_pins and_gate_0/y] [get_bd_pins or_gate_0/a]
connect_bd_net [get_bd_pins and_gate_1/y] [get_bd_pins or_gate_0/b]
connect_bd_net [get_bd_pins and_gate_2/y] [get_bd_pins or_gate_1/b]
connect_bd_net -net b1_1 [get_bd_pins b1] [get_bd_pins and_gate_1/b]
connect_bd_net -net b2_1 [get_bd_pins b2] [get_bd_pins and_gate_2/b]
connect_bd_net [get_bd_pins b] [get_bd_pins and_gate_0/b]
connect_bd_net [get_bd_pins or_gate_0/y] [get_bd_pins or_gate_1/a]
connect_bd_net [get_bd_pins or_gate_1/y] [get_bd_pins y]

current_bd_instance /controlor/uir_slct/slct3
connect_bd_net -net a1_1 [get_bd_pins a1] [get_bd_pins and_gate_1/a]
connect_bd_net -net a2_1 [get_bd_pins a2] [get_bd_pins and_gate_2/a]
connect_bd_net [get_bd_pins a] [get_bd_pins and_gate_0/a]
connect_bd_net [get_bd_pins and_gate_0/y] [get_bd_pins or_gate_0/a]
connect_bd_net [get_bd_pins and_gate_1/y] [get_bd_pins or_gate_0/b]
connect_bd_net [get_bd_pins and_gate_2/y] [get_bd_pins or_gate_1/b]
connect_bd_net -net b1_1 [get_bd_pins b1] [get_bd_pins and_gate_1/b]
connect_bd_net -net b2_1 [get_bd_pins b2] [get_bd_pins and_gate_2/b]
connect_bd_net [get_bd_pins b] [get_bd_pins and_gate_0/b]
connect_bd_net [get_bd_pins or_gate_0/y] [get_bd_pins or_gate_1/a]
connect_bd_net [get_bd_pins or_gate_1/y] [get_bd_pins y]

current_bd_instance /controlor/uir_slct/slct4
connect_bd_net -net a1_1 [get_bd_pins a1] [get_bd_pins and_gate_1/a]
connect_bd_net -net a2_1 [get_bd_pins a2] [get_bd_pins and_gate_2/a]
connect_bd_net [get_bd_pins a] [get_bd_pins and_gate_0/a]
connect_bd_net [get_bd_pins and_gate_0/y] [get_bd_pins or_gate_0/a]
connect_bd_net [get_bd_pins and_gate_1/y] [get_bd_pins or_gate_0/b]
connect_bd_net [get_bd_pins and_gate_2/y] [get_bd_pins or_gate_1/b]
connect_bd_net -net b1_1 [get_bd_pins b1] [get_bd_pins and_gate_1/b]
connect_bd_net -net b2_1 [get_bd_pins b2] [get_bd_pins and_gate_2/b]
connect_bd_net [get_bd_pins b] [get_bd_pins and_gate_0/b]
connect_bd_net [get_bd_pins or_gate_0/y] [get_bd_pins or_gate_1/a]
connect_bd_net [get_bd_pins or_gate_1/y] [get_bd_pins y]

current_bd_instance /controlor/uir_slct/slct5
connect_bd_net -net a1_1 [get_bd_pins a1] [get_bd_pins and_gate_1/a]
connect_bd_net -net a2_1 [get_bd_pins a2] [get_bd_pins and_gate_2/a]
connect_bd_net [get_bd_pins a] [get_bd_pins and_gate_0/a]
connect_bd_net [get_bd_pins and_gate_0/y] [get_bd_pins or_gate_0/a]
connect_bd_net [get_bd_pins and_gate_1/y] [get_bd_pins or_gate_0/b]
connect_bd_net [get_bd_pins and_gate_2/y] [get_bd_pins or_gate_1/b]
connect_bd_net -net b1_1 [get_bd_pins b1] [get_bd_pins and_gate_1/b]
connect_bd_net -net b2_1 [get_bd_pins b2] [get_bd_pins and_gate_2/b]
connect_bd_net [get_bd_pins b] [get_bd_pins and_gate_0/b]
connect_bd_net [get_bd_pins or_gate_0/y] [get_bd_pins or_gate_1/a]
connect_bd_net [get_bd_pins or_gate_1/y] [get_bd_pins y]

current_bd_instance /controlor/uir_slct/slct6
connect_bd_net -net a1_1 [get_bd_pins a1] [get_bd_pins and_gate_1/a]
connect_bd_net -net a2_1 [get_bd_pins a2] [get_bd_pins and_gate_2/a]
connect_bd_net [get_bd_pins a] [get_bd_pins and_gate_0/a]
connect_bd_net [get_bd_pins and_gate_0/y] [get_bd_pins or_gate_0/a]
connect_bd_net [get_bd_pins and_gate_1/y] [get_bd_pins or_gate_0/b]
connect_bd_net [get_bd_pins and_gate_2/y] [get_bd_pins or_gate_1/b]
connect_bd_net -net b1_1 [get_bd_pins b1] [get_bd_pins and_gate_1/b]
connect_bd_net -net b2_1 [get_bd_pins b2] [get_bd_pins and_gate_2/b]
connect_bd_net [get_bd_pins b] [get_bd_pins and_gate_0/b]
connect_bd_net [get_bd_pins or_gate_0/y] [get_bd_pins or_gate_1/a]
connect_bd_net [get_bd_pins or_gate_1/y] [get_bd_pins y]

current_bd_instance /controlor/uir_slct/slct7
connect_bd_net -net a1_1 [get_bd_pins a1] [get_bd_pins and_gate_1/a]
connect_bd_net -net a2_1 [get_bd_pins a2] [get_bd_pins and_gate_2/a]
connect_bd_net [get_bd_pins a] [get_bd_pins and_gate_0/a]
connect_bd_net [get_bd_pins and_gate_0/y] [get_bd_pins or_gate_0/a]
connect_bd_net [get_bd_pins and_gate_1/y] [get_bd_pins or_gate_0/b]
connect_bd_net [get_bd_pins and_gate_2/y] [get_bd_pins or_gate_1/b]
connect_bd_net -net b1_1 [get_bd_pins b1] [get_bd_pins and_gate_1/b]
connect_bd_net -net b2_1 [get_bd_pins b2] [get_bd_pins and_gate_2/b]
connect_bd_net [get_bd_pins b] [get_bd_pins and_gate_0/b]
connect_bd_net [get_bd_pins or_gate_0/y] [get_bd_pins or_gate_1/a]
connect_bd_net [get_bd_pins or_gate_1/y] [get_bd_pins y]

current_bd_instance /controlor/uir_slct/slct8
connect_bd_net -net a1_1 [get_bd_pins a1] [get_bd_pins and_gate_1/a]
connect_bd_net -net a2_1 [get_bd_pins a2] [get_bd_pins and_gate_2/a]
connect_bd_net [get_bd_pins a] [get_bd_pins and_gate_0/a]
connect_bd_net [get_bd_pins and_gate_0/y] [get_bd_pins or_gate_0/a]
connect_bd_net [get_bd_pins and_gate_1/y] [get_bd_pins or_gate_0/b]
connect_bd_net [get_bd_pins and_gate_2/y] [get_bd_pins or_gate_1/b]
connect_bd_net -net b1_1 [get_bd_pins b1] [get_bd_pins and_gate_1/b]
connect_bd_net -net b2_1 [get_bd_pins b2] [get_bd_pins and_gate_2/b]
connect_bd_net [get_bd_pins b] [get_bd_pins and_gate_0/b]
connect_bd_net [get_bd_pins or_gate_0/y] [get_bd_pins or_gate_1/a]
connect_bd_net [get_bd_pins or_gate_1/y] [get_bd_pins y]

current_bd_instance /controlor/uir_slct/slct9
connect_bd_net -net a1_1 [get_bd_pins a1] [get_bd_pins and_gate_1/a]
connect_bd_net -net a2_1 [get_bd_pins a2] [get_bd_pins and_gate_2/a]
connect_bd_net [get_bd_pins a] [get_bd_pins and_gate_0/a]
connect_bd_net [get_bd_pins and_gate_0/y] [get_bd_pins or_gate_0/a]
connect_bd_net [get_bd_pins and_gate_1/y] [get_bd_pins or_gate_0/b]
connect_bd_net [get_bd_pins and_gate_2/y] [get_bd_pins or_gate_1/b]
connect_bd_net -net b1_1 [get_bd_pins b1] [get_bd_pins and_gate_1/b]
connect_bd_net -net b2_1 [get_bd_pins b2] [get_bd_pins and_gate_2/b]
connect_bd_net [get_bd_pins b] [get_bd_pins and_gate_0/b]
connect_bd_net [get_bd_pins or_gate_0/y] [get_bd_pins or_gate_1/a]
connect_bd_net [get_bd_pins or_gate_1/y] [get_bd_pins y]

current_bd_instance /controlor/decode_32_0
connect_bd_net [get_bd_pins bus_to_single_4_0/o1] [get_bd_pins o1]
connect_bd_net [get_bd_pins decoder_2to4_0/out] [get_bd_pins bus_to_single_4_0/i]
connect_bd_net [get_bd_pins enable] [get_bd_pins decoder_2to4_0/enable]
connect_bd_net [get_bd_pins single_2_to_bus_0/o] [get_bd_pins decoder_2to4_0/addr]
connect_bd_net -net upc_0_o11 [get_bd_pins i0] [get_bd_pins single_2_to_bus_0/i0]
connect_bd_net -net upc_0_o12 [get_bd_pins i1] [get_bd_pins single_2_to_bus_0/i1]

current_bd_instance /
connect_bd_net [get_bd_pins adder/o] [get_bd_pins register_16bit_6/data_in]
connect_bd_net [get_bd_pins adpt_out_final_0_0/led] [get_bd_pins cg_fpga_0/gpio_led]
connect_bd_net [get_bd_pins and_gate_0/y] [get_bd_pins ram_0/clk]
connect_bd_net [get_bd_pins bus_mux_16_0/bus] \
  [get_bd_pins adder/i4] [get_bd_pins register_16bit_0/data_in] [get_bd_pins register_16bit_1/data_in] \
  [get_bd_pins register_16bit_2/data_in] [get_bd_pins register_16bit_3/data_in] [get_bd_pins register_16bit_5/data_in] \
  [get_bd_pins register_16bit_7/data_in] [get_bd_pins register_16bit_4/data_in]
connect_bd_net -net cg_fpga_0_btn_clk [get_bd_pins not_gate_0/y] \
  [get_bd_pins controlor/a] [get_bd_pins pc/a] [get_bd_pins controlor/enable] [get_bd_pins and_gate_0/a] \
  [get_bd_pins register_16bit_0/clk] [get_bd_pins register_16bit_1/clk] [get_bd_pins register_16bit_2/clk] \
  [get_bd_pins register_16bit_3/clk] [get_bd_pins register_16bit_6/clk] [get_bd_pins register_16bit_5/clk] \
  [get_bd_pins register_16bit_7/clk] [get_bd_pins register_16bit_8/clk] [get_bd_pins register_16bit_4/clk] \
  [get_bd_pins pc_0/clk]
connect_bd_net [get_bd_pins cg_fpga_0/btn_clk] [get_bd_pins not_gate_0/a]
connect_bd_net [get_bd_pins cg_fpga_0/btn_rst] \
  [get_bd_pins pc/CR] [get_bd_pins controlor/CR] [get_bd_pins register_16bit_0/reset] [get_bd_pins register_16bit_1/reset] \
  [get_bd_pins register_16bit_2/reset] [get_bd_pins register_16bit_3/reset] [get_bd_pins register_16bit_6/reset] \
  [get_bd_pins register_16bit_5/reset] [get_bd_pins register_16bit_7/reset] [get_bd_pins register_16bit_8/reset] \
  [get_bd_pins register_16bit_4/reset]
connect_bd_net [get_bd_pins controlor/data_out] [get_bd_pins adpt_out_final_0_0/rom]
connect_bd_net [get_bd_pins controlor/o3] [get_bd_pins adpt_out_12_0_0/sel]
connect_bd_net [get_bd_pins controlor/o23] [get_bd_pins or_gate_0/b]
connect_bd_net -net decode_32_0_o1 [get_bd_pins controlor/o1] [get_bd_pins pc/b]
connect_bd_net -net decode_32_1_o0 [get_bd_pins controlor/o0] [get_bd_pins not_gate_1/a]
connect_bd_net -net decode_32_1_o2 [get_bd_pins controlor/o2] [get_bd_pins or_gate_0/a] [get_bd_pins ram_0/we]
connect_bd_net -net decode_39_o [get_bd_pins controlor/o] [get_bd_pins bus_mux_16_0/sel]
connect_bd_net -net decode_39_o1 [get_bd_pins controlor/o8] [get_bd_pins register_16bit_0/read_en]
connect_bd_net -net decode_39_o2 [get_bd_pins controlor/o6] [get_bd_pins register_16bit_1/read_en]
connect_bd_net -net decode_39_o3 [get_bd_pins controlor/o5] [get_bd_pins register_16bit_2/read_en]
connect_bd_net -net decode_39_o4 [get_bd_pins controlor/o4] [get_bd_pins register_16bit_3/read_en]
connect_bd_net -net decode_39_o5 [get_bd_pins controlor/o9] [get_bd_pins register_16bit_6/read_en]
connect_bd_net -net decode_39_o6 [get_bd_pins controlor/o10] [get_bd_pins register_16bit_8/read_en]
connect_bd_net -net decode_39_o7 [get_bd_pins controlor/o7] [get_bd_pins pc/read_en]
connect_bd_net -net decode_40_o1 [get_bd_pins controlor/o14] [get_bd_pins register_16bit_0/write_en]
connect_bd_net -net decode_40_o2 [get_bd_pins controlor/o13] [get_bd_pins register_16bit_1/write_en]
connect_bd_net -net decode_40_o3 [get_bd_pins controlor/o12] [get_bd_pins register_16bit_2/write_en]
connect_bd_net -net decode_40_o4 [get_bd_pins controlor/o11] [get_bd_pins register_16bit_3/write_en]
connect_bd_net -net decode_40_o5 [get_bd_pins controlor/o15] [get_bd_pins register_16bit_7/write_en]
connect_bd_net -net decode_40_o6 [get_bd_pins controlor/o16] [get_bd_pins register_16bit_4/write_en]
connect_bd_net -net decode_40_o7 [get_bd_pins controlor/o17] [get_bd_pins register_16bit_5/write_en]
connect_bd_net [get_bd_pins not_gate_1/y] [get_bd_pins and_gate_0/b]
connect_bd_net [get_bd_pins or_gate_0/y] [get_bd_pins register_16bit_4/read_en]
connect_bd_net [get_bd_pins pc_0/o5] [get_bd_pins controlor/a3]
connect_bd_net [get_bd_pins pc_0/o6] [get_bd_pins controlor/a5]
connect_bd_net [get_bd_pins pc_0/o10] [get_bd_pins controlor/a9]
connect_bd_net [get_bd_pins pc_0/o11] [get_bd_pins controlor/a11]
connect_bd_net [get_bd_pins pc_0/o12] [get_bd_pins controlor/a13]
connect_bd_net [get_bd_pins pc_0/o13] [get_bd_pins controlor/a15]
connect_bd_net [get_bd_pins pc_0/o14] [get_bd_pins controlor/a17]
connect_bd_net [get_bd_pins pc_0/o15] [get_bd_pins controlor/a19]
connect_bd_net [get_bd_pins pc/data_out] [get_bd_pins bus_mux_16_0/PC]
connect_bd_net -net ram_0_data_out [get_bd_pins ram_0/q] [get_bd_pins register_16bit_8/data_in]
connect_bd_net [get_bd_pins register_16bit_0/data_out] [get_bd_pins bus_mux_16_0/IR] [get_bd_pins adpt_out_final_0_0/ram] [get_bd_pins pc_0/i]
connect_bd_net [get_bd_pins register_16bit_1/data_out] [get_bd_pins bus_mux_16_0/R0]
connect_bd_net [get_bd_pins register_16bit_2/data_out] [get_bd_pins bus_mux_16_0/R1]
connect_bd_net [get_bd_pins register_16bit_3/data_out] [get_bd_pins bus_mux_16_0/R2]
connect_bd_net [get_bd_pins register_16bit_4/data_out] [get_bd_pins trans1_0/i]
connect_bd_net [get_bd_pins register_16bit_5/data_out] [get_bd_pins ram_0/data_in]
connect_bd_net [get_bd_pins register_16bit_6/data_out] [get_bd_pins bus_mux_16_0/Z]
connect_bd_net [get_bd_pins register_16bit_7/data_out] [get_bd_pins adder/i]
connect_bd_net [get_bd_pins register_16bit_8/data_out] [get_bd_pins bus_mux_16_0/DR]
connect_bd_net [get_bd_pins trans1_0/o] [get_bd_pins ram_0/addr]
connect_bd_net -net upc_0_o9 [get_bd_pins controlor/a2] [get_bd_pins register_16bit_8/write_en]
connect_bd_net -net upc_0_o10 [get_bd_pins controlor/a4] [get_bd_pins register_16bit_6/write_en]
connect_bd_net -net upc_0_o16 [get_bd_pins controlor/a16] [get_bd_pins register_16bit_5/read_en]
connect_bd_net -net upc_0_o17 [get_bd_pins controlor/a18] [get_bd_pins adder/cin]
connect_bd_net -net upc_0_o18 [get_bd_pins controlor/o18] [get_bd_pins adder/i0]
connect_bd_net -net upc_0_o19 [get_bd_pins controlor/o19] [get_bd_pins adder/i1]
connect_bd_net -net upc_0_o20 [get_bd_pins controlor/o20] [get_bd_pins adder/i2]
connect_bd_net -net upc_0_o21 [get_bd_pins controlor/o21] [get_bd_pins adder/i3]
connect_bd_net -net upc_0_o22 [get_bd_pins controlor/o22] [get_bd_pins adder/m]
connect_bd_net [get_bd_pins xlconstant_0/dout] [get_bd_pins controlor/a1]
connect_bd_net [get_bd_pins xlconstant_1/dout] [get_bd_pins pc/LD] [get_bd_pins controlor/a7] [get_bd_pins register_16bit_7/read_en]

validate_bd_design
save_bd_design
